# EAGLE design controller (EAGLE 6.4)
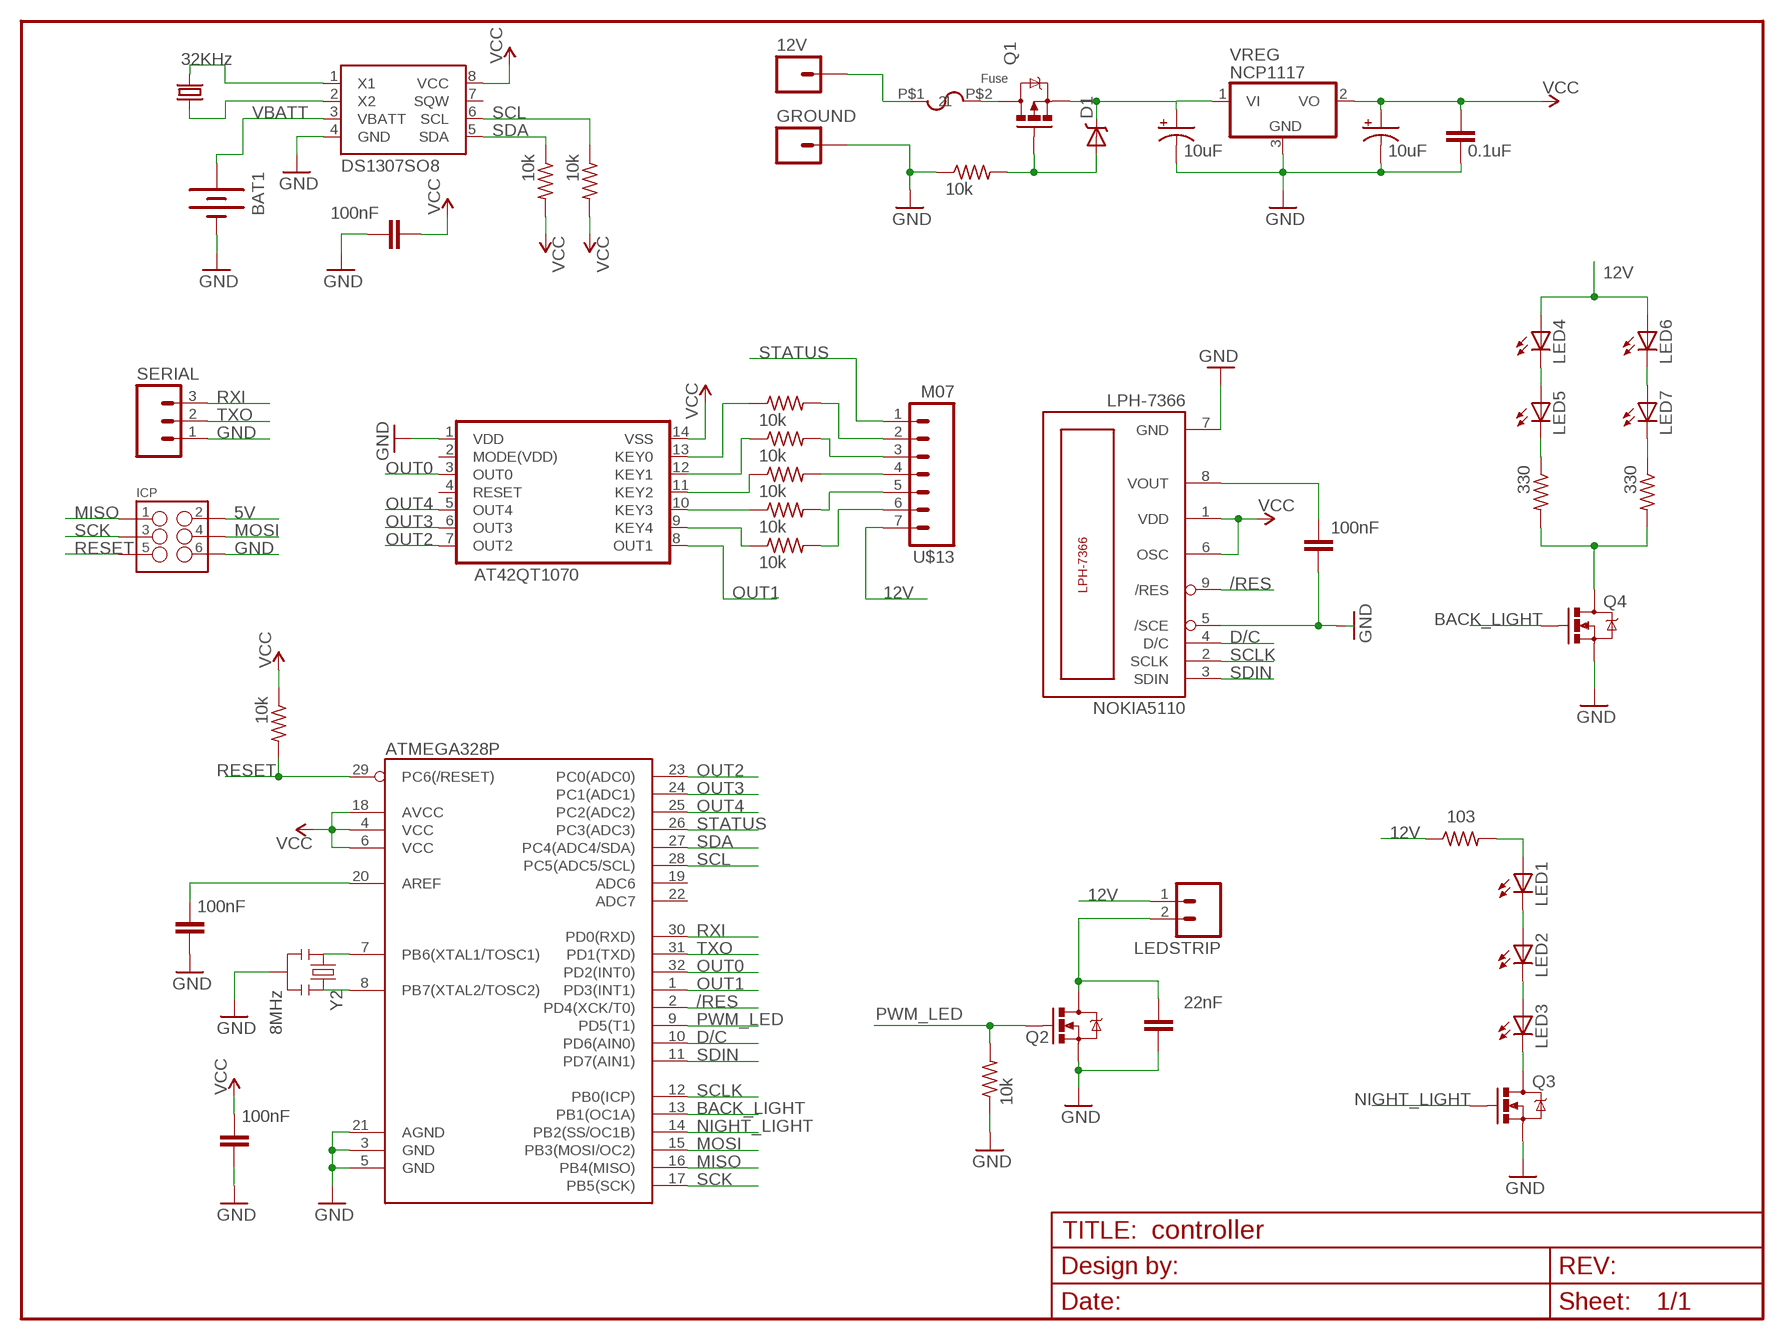
[diagram p0: schematic, sheet 1]

## Parts
12V  M01PTH_LONGPAD  [1X01_LONGPAD]
AT42QT1070  AT42QT1070  [SOIC-14]
BAT1  BATTERY12MM  [BATTCON_12MM]
C1  100nF  CAP0805  [0805]
C2  100nF  CAP0805  [0805]
C3  100nF  CAP0805  [0805]
C4  22nF  CAP0805  [0805]
C5  10uF  CAP_POL1206-KIT  [EIA3216-KIT]
C6  100nF  CAP0805  [0805]
C7  10uF  CAP_POL1206-KIT  [EIA3216-KIT]
C8  0.1uF  CAP0805  [0805]
D1  DIODE-SCHOTTKYDO-214AA  [DO-214AA]
GROUND  M01PTH_LONGPAD  [1X01_LONGPAD]
ICP  M03X2POGO_PINS  [2X3_POGO]
LED1  LED  [SIDEVIEW-LED]
LED2  LED  [SIDEVIEW-LED]
LED3  LED  [SIDEVIEW-LED]
LED4  LED0603  [LED-0603]
LED5  LED0603  [LED-0603]
LED6  LED0603  [LED-0603]
LED7  LED0603  [LED-0603]
LEDSTRIP  M02LOCK_LONGPADS  [1X02_LOCK_LONGPADS]
NOKIA5110  LPH-7366  [NOKIA5110]
Q1  MOSFET_PCHANNEL  [DPAK]
Q2  MOSFET-NCHANNELFDD8780  [DPAK@1]
Q3  MOSFET-NCHANNELBSS123LT1G  [SOT23]
Q4  MOSFET-NCHANNELBSS123LT1G  [SOT23]
SERIAL  M03POGO_PIN_HOLES_ONLY  [1X03_PP_HOLES_ONLY]
U1  ATMEGA328P  ATMEGA328_SMT  [TQFP32-08]
U$1  FRAME_LETTER  [CREATIVE_COMMONS]
U$2  10k  RESISTOR  [RESISTOR-0805]
U$3  DS1307SO8  [SO08]
U$4  10k  RESISTOR  [RESISTOR-0805]
U$5  10k  RESISTOR  [RESISTOR-0805]
U$7  10k  RESISTOR  [RESISTOR-0805]
U$8  10k  RESISTOR  [RESISTOR-0805]
U$9  10k  RESISTOR  [RESISTOR-0805]
U$10  10k  RESISTOR  [RESISTOR-0805]
U$11  10k  RESISTOR  [RESISTOR-0805]
U$12  Fuse  FUSE  [FUSE-LITTLE-251]
U$13  M07  [M07-SMD]
U$14  10k  RESISTOR  [RESISTOR-0805]
U$15  10k  RESISTOR  [RESISTOR-0805]
U$16  103  RESISTOR  [RESISTOR-0805]
U$17  330  RESISTOR  [RESISTOR-0805]
U$18  330  RESISTOR  [RESISTOR-0805]
VREG  NCP1117  7805DT  [TO252]
Y1  32KHz  CRYSTAL32-SMD  [CRYSTAL-32KHZ-SMD]
Y2  8MHz  RESONATOR16MHZ  [RESONATOR-SMD]

## Nets
5V [5V]: AT42QT1070.14(VSS) C2.1 C3.1 C7.A(+) C8.1 ICP.P$2 NOKIA5110.1(VDD) NOKIA5110.6(OSC) U1.4(VCC) U1.6(VCC) U1.18(AVCC) U$2.1 U$3.8(VCC) U$4.2 U$5.2 VREG.2(VO) ; supply symbol labelled VCC
12V: C5.A(+) D1.C LED4.A LED6.A LEDSTRIP.1 Q1.3(S) U$13.7 U$16.1 VREG.1(VI)
/RES: NOKIA5110.9(/RES) U1.2(PD4(XCK/T0))
BACK_LIGHT: Q4.1(G) U1.13(PB1(OC1A))
D/C: NOKIA5110.4(D/C) U1.10(PD6(AIN0))
GND: AT42QT1070.1(VDD) BAT1.GND(-) C1.2 C2.2 C3.2 C4.1 C5.C(-) C6.1 C7.C(-) C8.2 GROUND.1 ICP.P$6 NOKIA5110.5(/SCE) NOKIA5110.7(GND) Q2.3(S) Q3.2(S) Q4.2(S) SERIAL.1 U1.3(GND) U1.5(GND) U1.21(AGND) U$3.4(GND) U$14.1 U$15.1 VREG.3(GND) Y2.2
KEY0: AT42QT1070.13(KEY0) U$7.1
KEY1: AT42QT1070.12(KEY1) U$8.1
KEY2: AT42QT1070.11(KEY2) U$9.1
KEY3: AT42QT1070.10(KEY3) U$10.1
KEY4: AT42QT1070.9(KEY4) U$11.1
MISO: ICP.P$1 U1.16(PB4(MISO))
MOSI: ICP.P$4 U1.15(PB3(MOSI/OC2))
N$1: U1.7(PB6(XTAL1/TOSC1)) Y2.1
N$2: LED7.C U$18.1
N$4: U1.8(PB7(XTAL2/TOSC2)) Y2.3
N$5: LED4.C LED5.A
N$6: U$3.1(X1) Y1.X2
N$7: U$3.2(X2) Y1.X1
N$8: 12V.1 U$12.P$1
N$9: LED5.C U$17.1
N$10: Q4.3(D) U$17.2 U$18.2
N$11: C1.1 U1.20(AREF)
N$12: LED1.P$1(A) U$16.2
N$13: Q1.4(D) U$12.P$2
N$14 [12V]: C4.2 LEDSTRIP.2 Q2.4(D)
N$15: LED1.P$2(C) LED2.P$1(A)
N$16: D1.A Q1.1(G) U$14.2
N$17: LED6.C LED7.A
N$19: U$9.2 U$13.4
N$20: C6.2 NOKIA5110.8(VOUT)
N$21: U$11.2 U$13.6
N$22: LED2.P$2(C) LED3.P$1(A)
N$28: U$10.2 U$13.5
N$30: U$8.2 U$13.3
N$31: U$7.2 U$13.2
N$33: LED3.P$2(C) Q3.3(D)
NIGHT_LIGHT: Q3.1(G) U1.14(PB2(SS/OC1B))
OUT0: AT42QT1070.3(OUT0) U1.32(PD2(INT0))
OUT1: AT42QT1070.8(OUT1) U1.1(PD3(INT1))
OUT2: AT42QT1070.7(OUT2) U1.23(PC0(ADC0))
OUT3: AT42QT1070.6(OUT3) U1.24(PC1(ADC1))
OUT4: AT42QT1070.5(OUT4) U1.25(PC2(ADC2))
PWM_LED: Q2.1(G) U1.9(PD5(T1)) U$15.2
RESET: ICP.P$5 U1.29(PC6(/RESET)) U$2.2
RXI: SERIAL.3 U1.30(PD0(RXD))
SCK: ICP.P$3 U1.17(PB5(SCK))
SCL: U1.28(PC5(ADC5/SCL)) U$3.6(SCL) U$5.1
SCLK: NOKIA5110.2(SCLK) U1.12(PB0(ICP))
SDA: U1.27(PC4(ADC4/SDA)) U$3.5(SDA) U$4.1
SDIN: NOKIA5110.3(SDIN) U1.11(PD7(AIN1))
STATUS: U1.26(PC3(ADC3)) U$13.1
TXO: SERIAL.2 U1.31(PD1(TXD))
VBATT: BAT1.PWR@1(+) U$3.3(VBATT)
Unconnected: AT42QT1070.2(MODE(VDD)) AT42QT1070.4(RESET) U1.19(ADC6) U1.22(ADC7) U$3.7(SQW)

## Library data of the parts
12V GROUND = SparkFun-Connectors:M01: Header 1 Standard 1-pin 0.1" header. Use with straight break away headers (SKU : PRT-00116), right angle break away headers (PRT-00553), swiss pins (PRT-00743), machine pins (PRT-00117), and female headers (PRT-00115).
AT42QT1070 = jt_parts:AT42QT1070: Modified from the Sparkfun footprint
BAT1 = SparkFun-Electromechanical:BATTERY: Battery Holders Various common sizes : AA, AAA, 20mm coin cell and 12mm coin cell. 20MM_4LEGS, BATT-10373
C1-C4 C6 C8 = SparkFun-Capacitors:CAP: Capacitor Standard 0603 ceramic capacitor, and 0.1" leaded capacitor.
C5 C7 = SparkFun-Capacitors:CAP_POL: Capacitor Polarized These are standard SMD and PTH capacitors. Normally 10uF, 47uF, and 100uF in electrolytic and tantalum varieties. Always verify the external diameter of the through hole cap, it varies with capacity, voltage, and manufacturer. The EIA devices should be standard.
D1 = jt_parts:DIODE-SCHOTTKY
ICP = SparkFun-Connectors:M03X2: 2x3 .1" header. Shrouded, with keying- CONN-10681 SMT- CONN-11415 Pogo pins- HW-11044; PROD_ID: HW-11044
LED1-LED3 = jt_parts:LED
LED4-LED7 = SparkFun-LED:LED: LEDs Standard schematic elements and footprints for 5mm, 3mm, 1206, and 0603 sized LEDs. 5mm - Spark Fun Electronics SKU : COM-00529 (and others)
LEDSTRIP = SparkFun-Connectors:M02: Standard 2-pin 0.1" header. Use with - straight break away headers ( PRT-00116) - right angle break away headers (PRT-00553) - swiss pins (PRT-00743) - machine pins (PRT-00117) - female headers (PRT-00115) Molex polarized connector foot print use with: PRT-08233 with associated crimp pins and housings. 2.54_SCREWTERM for use with PRT-10571. 3.5mm Screw Terminal footprints for PRT-08084 5mm Screw Terminal footprints for use with PRT-08433
NOKIA5110 = jt_parts:LPH-7366
Q1 = jt_parts:MOSFET_PCHANNEL
Q2 = SparkFun-DiscreteSemi:MOSFET-NCHANNEL: Common NMOSFET Parts MFG P/N Store ID Prod ID FDD8780 TRANS-09984 SI7820DN TRANS-11055 FDS6630A IC-08089 2N7002PW TRANS-11151 FQP30N06L COM-10213 TRANS-10060 BSS123LT1G TRANS-08345 BSS138 TRANS-00830 BS170 2N7000; PROD_ID: TRANS-09984
Q3 Q4 = SparkFun-DiscreteSemi:MOSFET-NCHANNEL: Common NMOSFET Parts MFG P/N Store ID Prod ID FDD8780 TRANS-09984 SI7820DN TRANS-11055 FDS6630A IC-08089 2N7002PW TRANS-11151 FQP30N06L COM-10213 TRANS-10060 BSS123LT1G TRANS-08345 BSS138 TRANS-00830 BS170 2N7000; PROD_ID: TRANS-08345
SERIAL = SparkFun-Connectors:M03: Header 3 Standard 3-pin 0.1" header. Use with straight break away headers (SKU : PRT-00116), right angle break away headers (PRT-00553), swiss pins (PRT-00743), machine pins (PRT-00117), and female headers (PRT-00115). Molex polarized connector foot print use with SKU : PRT-08232 with associated crimp pins and housings.
U1 = SparkFun-DigitalIC:ATMEGA328_SMT: 32-Pin Atmega328 part Commonly used on Arduino compatible boards Available in QFP and QFN packages TQFP is IC-09069 QFN is non-stock; PROD_ID: IC-09069
U$1 = jt_parts:FRAME_LETTER: 8.5" x 11" document frame modified from the Sparkfun Aesthetics Library
U$2 U$4 U$5 U$7-U$11 U$14-U$18 = jt_parts:RESISTOR: Resistor footprints. 0805 modified from Adafruit library.
U$3 = SparkFun-FreqCtrl:DS1307: I2C real-time clock with battery backup.
U$12 = jt_parts:FUSE
U$13 = jt_parts:M07
VREG = adafruit:78*: Positive VOLTAGE REGULATOR Added bigger pads to the TO-92 package
Y1 = SparkFun-FreqCtrl:CRYSTAL: Various standard crystals. Proven footprints. Spark Fun Electronics SKU : COM-00534
Y2 = SparkFun-FreqCtrl:RESONATOR: Resonator Small SMD resonator. Used, eg, on the Arduino Pro/ Pro Mini boards. 8MHz- XTAL-08895 16MHz- XTAL-08900; PROD_ID: XTAL-08900; VALUE: 16MHz

## Net classes
0 default: width 0.254 mm, clearance 0.203 mm
1 12V: width 2.032 mm, clearance 0.508 mm
2 5V: width 0.305 mm, clearance 0.203 mm

## Board
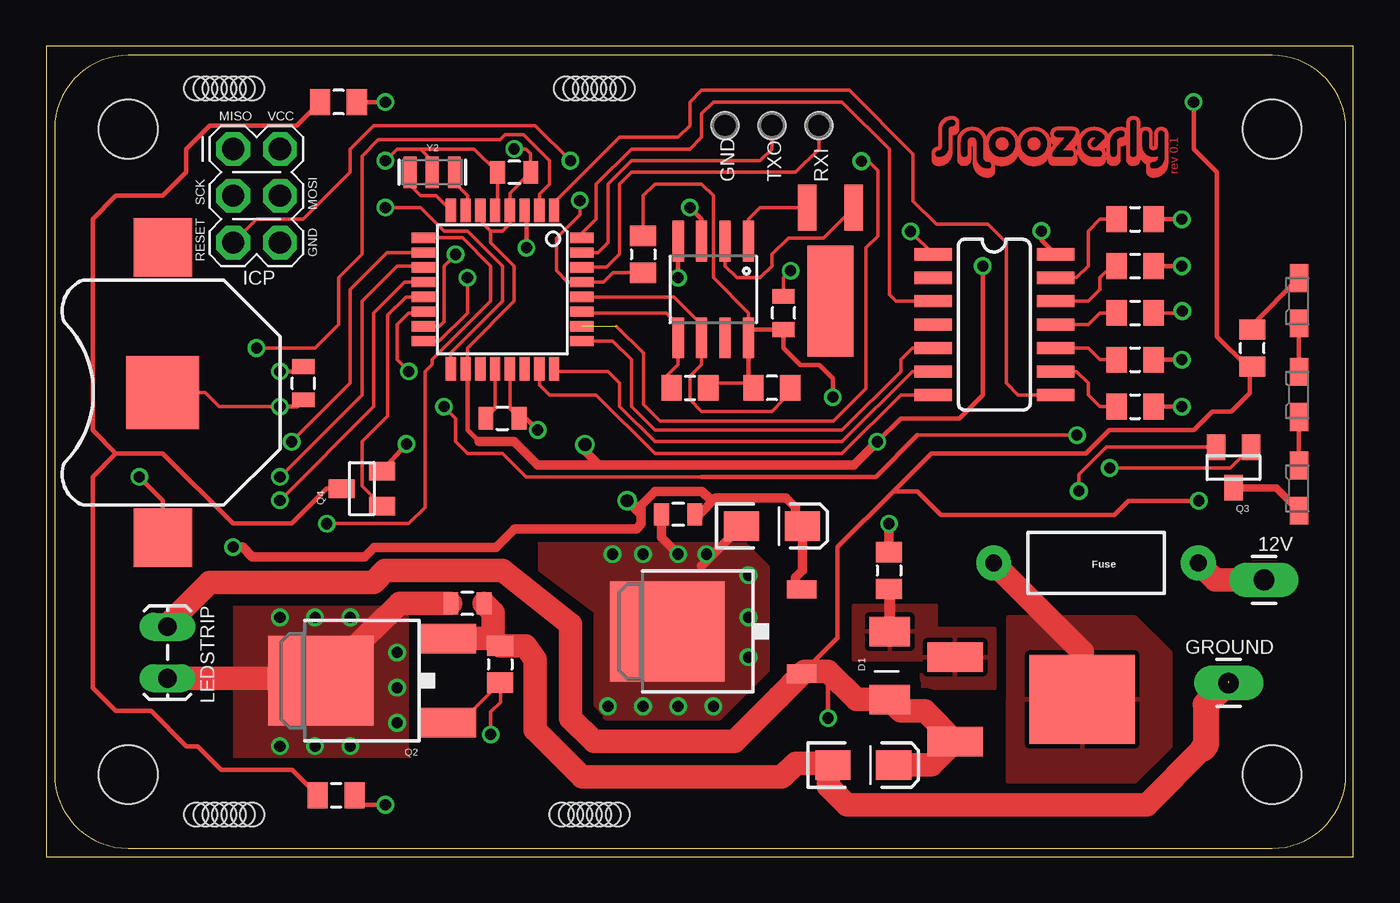
[diagram p1: board, top side]
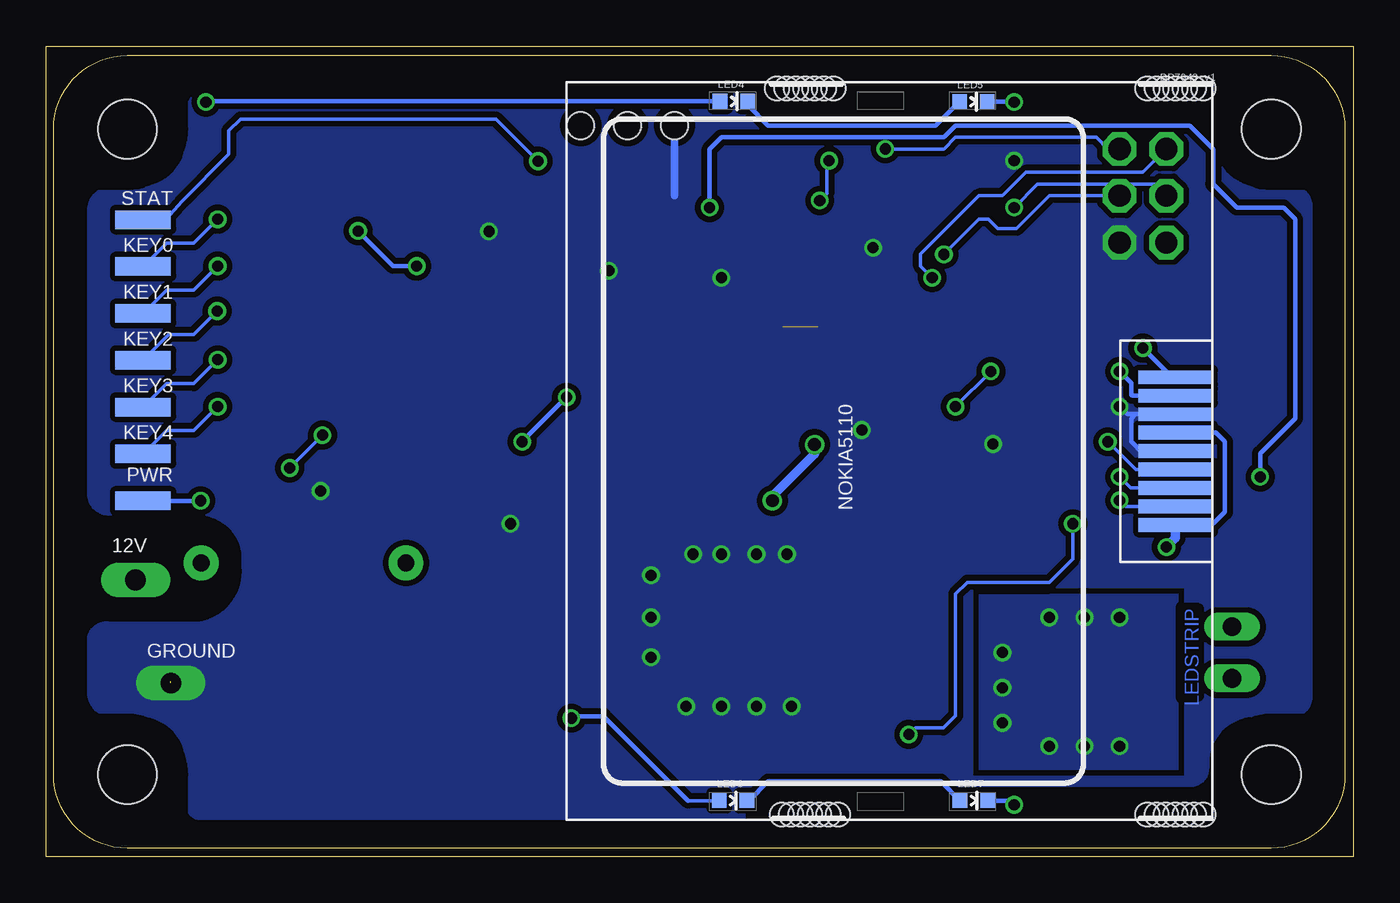
[diagram p2: board, bottom side, seen from below]

Size 70.87 x 43.95 mm. Coordinates in mm from the lower left corner, seen from the top.
Outline: 0,0 70.87,0 70.87,43.95 0,43.95 0,0
Copper layers (1*16): Top 0.0356mm / dielectric 1.5011mm / Bottom 0.0356mm
Design rules "LaenPCBOrder": minimum track width 6mil, minimum drill 13mil, track to track 6mil, track to pad 6mil, pad to pad 6mil, via to via 6mil, smd to smd 6mil, copper to edge 15mil, drill to drill 6mil, minimum pad ring 7mil, minimum via ring 7mil, stop-mask expansion 3mil, vias tented up to drill 0mil, thermal gap 10mil
Holes 1.3 mm at 8.13,2.29 8.64,2.29 9.14,2.29 9.65,2.29 10.16,2.29 10.67,2.29 11.18,2.29 27.94,2.29 28.45,2.29 28.96,2.29 29.46,2.29 29.97,2.29 30.48,2.29 30.99,2.29 8.13,41.66 8.64,41.66 9.14,41.66 9.65,41.66 10.16,41.66 10.67,41.66 11.18,41.66 28.19,41.66 28.7,41.66 29.21,41.66 29.72,41.66 30.23,41.66 30.73,41.66 31.24,41.66

### Footprints (pad centres in the part's own frame; a part is rotated, then mirrored left to right if it is on the bottom)
1X01_LONGPAD = drill 1.118 pad 1.88 long: 1 0,0
SOIC-14 = smd 0.66 x 2.032: 1 -3.175,-3.315; 2 -1.905,-3.315; 3 -0.635,-3.315; 4 0.635,-3.315; 5 1.905,-3.315; 6 3.175,-3.315; 7 4.445,-3.315; 8 4.445,3.315; 9 3.175,3.315; 10 1.905,3.315; 11 0.635,3.315; 12 -0.635,3.315; 13 -1.905,3.315; 14 -3.175,3.315
BATTCON_12MM = smd 3.962 x 3.962: GND 0,0 | smd 3.175 x 3.175: PWR@1 -7.874,0; PWR@2 7.874,0
0805 = smd 0.8 x 1.2: 1 -0.9,0; 2 0.9,0
EIA3216-KIT = smd 1.9 x 1.6: A 1.65,0; C -1.65,0
DO-214AA = smd 1.6 x 2.2: A 2.16,-0.17; C -1.53,-0.17
2X3_POGO = drill 1.2 pad 1.829 octagon: P$1 0,0; P$2 0,2.54; P$3 2.54,0; P$4 2.54,2.54; P$5 5.08,0; P$6 5.08,2.54
SIDEVIEW-LED = smd 1 x 1.5: P$1 0,-1.25; P$2 0,1.2
LED-0603 = smd 0.8 x 0.8: A 0,-0.75; C 0,0.75
1X02_LOCK_LONGPADS = drill 1.016 long: 1 -0.127,0; 2 2.667,0
NOKIA5110 = smd 0.75 x 4: 1 4,17; 2 3,17; 3 2,17; 4 1,17; 5 0,17; 6 -1,17; 7 -2,17; 8 -3,17; 9 -4,17
DPAK = smd 1.6 x 3: 1 -2.28,-2.77; 3 2.28,-2.77 | smd 4.826 x 5.715: 4 0,4.128
DPAK' = smd 1.6 x 3: 1 -2.28,-5.31; 3 2.28,-5.31 | smd 4.826 x 5.715: 4 0,1.588
SOT23 = smd 1 x 1.4: 1 -0.95,-1.1; 2 0.95,-1.1; 3 0,1.1
1X03_PP_HOLES_ONLY = drill 0.9 pad 0.813: 1 0,0; 2 2.54,0; 3 5.08,0 | hole 1.473: 0,0; 2.54,0; 5.08,0
TQFP32-08 = smd 1.27 x 0.559: 1 -4.293,2.8; 2 -4.293,2; 3 -4.293,1.2; 4 -4.293,0.4; 5 -4.293,-0.4; 6 -4.293,-1.2; 7 -4.293,-2; 8 -4.293,-2.8; 17 4.293,-2.8; 18 4.293,-2; 19 4.293,-1.2; 20 4.293,-0.4; 21 4.293,0.4; 22 4.293,1.2; 23 4.293,2; 24 4.293,2.8 | smd 0.559 x 1.27: 9 -2.8,-4.293; 10 -2,-4.293; 11 -1.2,-4.293; 12 -0.4,-4.293; 13 0.4,-4.293; 14 1.2,-4.293; 15 2,-4.293; 16 2.8,-4.293; 25 2.8,4.293; 26 2,4.293; 27 1.2,4.293; 28 0.4,4.293; 29 -0.4,4.293; 30 -1.2,4.293; 31 -2,4.293; 32 -2.8,4.293
RESISTOR-0805 = smd 1.1 x 1.4: 1 -1,0; 2 1,0
SO08 = smd 0.61 x 2.21: 1 -1.905,-2.616; 2 -0.635,-2.616; 3 0.635,-2.616; 4 1.905,-2.616; 5 1.905,2.616; 6 0.635,2.616; 7 -0.635,2.616; 8 -1.905,2.616
FUSE-LITTLE-251 = drill 0.9 pad 1.88: P$1 -6.35,-0.03; P$2 4.75,-0.03
M07-SMD = smd 1 x 3: 1 -7.62,-0.08; 2 -5.08,-0.08; 3 -2.54,-0.08; 4 0,-0.08; 5 2.54,-0.08; 6 5.08,-0.08; 7 7.62,-0.08
DP7043_V1 = hole 3.2: 4,4; 66,4; 66,39; 4,39
TO252 = smd 1 x 1.6: 1 -2.28,-4.8; 2 2.28,-4.8 | smd 5.4 x 6.2: 3 0,2.5
CRYSTAL-32KHZ-SMD = smd 2.5 x 6: SHEILD 0,5.08 | smd 1 x 2.5: X1 -1.27,0; X2 1.27,0
RESONATOR-SMD = smd 0.7 x 1.7: 1 -1.2,0; 2 0,0; 3 1.2,0

### Placement (x,y rotation side)
12V  66.01,15.01 90 top
AT42QT1070  51.41,29.49 270 top
BAT1  6.32,25.17 90 top
C1  24.74,23.77 0 top
C2  25.37,37.11 180 top
C3  39.98,29.49 90 top
C4  22.83,13.74 180 top
C5  44.3,4.98 0 top
C6  13.94,25.68 90 top
C7  39.34,17.93 0 top
C8  34.26,18.57 180 top
D1  45.57,10.06 90 top
GROUND  64.11,9.42 90 top
ICP  10.13,38.38 270 top
LED1  67.92,30.12 180 top
LED2  67.92,25.04 180 top
LED3  67.92,19.96 180 top
LED4  33.58,40.97 270 bottom
LED5  20.6,40.94 270 bottom
LED6  33.63,3.05 270 bottom
LED7  20.57,3.05 270 bottom
LEDSTRIP  6.58,12.34 270 top
NOKIA5110  26.64,22 270 bottom
Q1  52.04,8.53 270 top
Q2  MOSFET-NCHANNELFDD8780  [DPAK']  16.48,9.55 90 top
Q3  64.36,21.11 180 top
Q4  17.12,19.96 90 top
SERIAL  36.8,39.65 0 top
U1  24.74,30.76 270 top
U$1  -15.24,-11.43 0 top  (outside the outline)
U$2  32.36,32.66 270 top
U$3  36.17,30.76 180 top
U$4  34.9,25.43 0 top
U$5  39.34,25.43 180 top
U$6  [SNOOZERLY_TOP]  48.01,36.83 0 top
U$7  59.03,34.57 0 top
U$8  59.03,32.03 0 top
U$9  59.03,29.49 0 top
U$10  59.03,26.95 0 top
U$11  59.03,24.41 0 top
U$12  56.11,15.9 180 top
U$13  65.53,26.92 270 bottom
U$14  45.69,15.52 270 top
U$15  24.61,10.44 270 top
U$16  65.38,27.58 90 top
U$17  15.85,40.92 180 top
U$18  15.72,3.33 180 top
U$20  [DP7043_V1]  70.46,43.46 180 top
VREG  36.17,12.22 90 top
Y1  42.52,35.2 180 top
Y2  20.93,37.11 180 top

### Tracks (layer width: path | path; a pad name or v marks a point on that pad's centre or on a via)
5V  (via drill 0.6, 0.7)
  Top 0.203: U1.6 23.47,34.98 23.47,34.57 24.11,33.93 | U1.18 22.84,26.56 22.84,27.58 25.38,30.12 25.38,32.03 24.11,33.3 24.11,33.93 | 24.11,33.93 24.74,33.93 25.14,34.33 U1.4 25.14,35.97 C2.1 26.27,38.11 26.01,38.38 v25.38,38.38 | 38.08,25.7 36.17,25.7 U$4.2 | 38.08,28.85 38.08,29.49 36.17,31.39 36.17,35.84 35.53,36.47 32.99,36.47 32.36,35.84 U$2.1 | 38.08,28.85 U$3.8 | 38.34,28.59 38.08,28.85
  Top 0.254: U$3.8 38.08,25.7 U$5.2 | 38.34,28.59 C3.1 39.98,27.58 40.89,26.67 41.91,26.67 42.65,25.93 v42.65,24.92 | C8.1 35.41,18.57 | v45.06,22.5 46.33,23.77 49.51,23.77 50.77,25.04 v50.77,32.03 | v53.95,33.93 53.95,33.44 AT42QT1070.14 | 23.47,22.5 22.84,23.14 22.84,26.37 U1.18
  Top 0.508: VREG.2 40.62,14.78 40.62,15.14 40.99,15.52 C7.A 40.62,18.31 40.62,18.95 40.11,19.46 36.3,19.46 36.23,19.39 | 35.41,18.57 36.23,19.39 | 29.97,21.23 43.79,21.23 v45.06,22.5 | 29.97,21.23 26.64,21.23 25.38,22.5 23.47,22.5 | v10.13,16.79 10.64,16.79 11.18,16.26 17.27,16.26 17.78,16.76 24.38,16.76 25.4,17.78 32,17.78 32.26,18.03 32.26,18.54 | 36.23,19.39 35.98,19.39 35.56,19.81 33.02,19.81 32.26,19.05 32.26,18.54 | 32.26,18.54 v31.5,19.3 | v29.21,22.35 29.21,22 29.97,21.23
  Bottom 0.203: ICP.P$2 13.31,38.38 13.95,39.01 21.57,39.01 22.2,38.38 v25.38,38.38
  Bottom 0.254: v42.65,24.92 v45.06,22.5 | v50.77,32.03 52.05,32.03 v53.95,33.93 | NOKIA5110.6 7.45,23 6.96,22.5 6.96,18.69 7.59,18.06 9.58,18.06 NOKIA5110.1
  Bottom 0.508: NOKIA5110.1 9.64,17.28 v10.13,16.79 | v31.5,19.3 31.5,19.56 29.21,21.84 v29.21,22.35
12V  (via drill 0.6)
  Top 0.254: v42.39,7.52 42.39,10.05 | v62.2,40.92 62.2,38.38 63.48,37.11 63.48,28.22 65.11,26.58 U$16.1 65.25,26.46 65.25,25.16 64.25,24.16 63.22,24.16 62.2,23.14 57.63,23.14 56.36,21.87 47.98,21.87 45.95,19.84 | VREG.1 42.9,11.87 42.9,16.79 45.95,19.84 | v62.48,19.3 58.67,19.3 57.91,18.54 48.51,18.54 47.24,19.81 45.97,19.81 45.95,19.84
  Top 1.27: 45.62,8.41 D1.C | C5.A 48,4.98 Q1.3 47.63,7.9 46.33,7.9 45.74,8.49 D1.C | LEDSTRIP.1 6.58,12.6 8.87,14.88 17.75,14.88 18.39,15.52 24.74,15.52 28.42,12.6 28.42,7.52 29.69,6.25 37.31,6.25 39.7,8.63 VREG.1 39.73,8.67 41.12,10.06 41.13,10.05 42.39,10.05 43.92,8.53 D1.C
  Bottom 0.203: LED6.A 36.07,3.05
  Bottom 0.254: LED4.A 62.15,40.97 v62.2,40.92 | 36.07,3.05 40.64,7.62 42.29,7.62 v42.39,7.52 | U$13.7 v62.48,19.3
/RES  (via drill 0.6)
  Top 0.203: v11.4,27.58 14.58,27.58 15.85,28.85 15.85,31.39 17.12,32.66 17.12,38 18.01,38.89 24.61,38.89 24.87,39.14 25.88,39.14 27.28,37.74 27.28,36.47 26.74,35.93 U1.2
  Bottom 0.254: NOKIA5110.9 9.82,26 v11.4,27.58
BACK_LIGHT
  Top 0.203: U1.13 19.51,30.36 18.52,29.36 18.52,23.9 17.12,22.5 17.12,20.09 17.14,20.09 Q4.1
D/C  (via drill 0.6)
  Top 0.203: U1.10 18.48,32.76 16.48,30.76 16.48,25.68 v13.31,22.5
  Bottom 0.203: NOKIA5110.4 11.8,21 v13.31,22.5
GND  (via drill 0.6)  (1 unrouted)
  Top 0.203: U1.21 25.14,24.27 C1.2 | U1.5 24.48,35.19 C2.2 23.2,38.38 20.3,38.38 | v18.39,37.74 19.02,38.38 20.3,38.38 | Y2.2 20.93,37.74 20.3,38.38 | 39.98,30.76 39.98,31.39 v40.36,31.77 | v12.68,24.41 9.37,24.41 8.61,25.17 BAT1.GND | 19.49,22.33 v19.53,22.38 | Q3.2 57.46,22.21 55.98,20.73 v55.98,19.84 | AT42QT1070.1 48.09,32.68 v46.86,33.91
  Top 0.254: C1.2 26.01,23.77 v26.64,23.14 | U$3.4 v34.27,31.39 | C3.2 39.98,30.76 | v12.68,24.41 13.57,24.41 C6.1 | Q4.2 19.49,22.33 | v26.04,33.02 26.04,34.96 U1.3
  Top 0.508: C7.C 35.54,15.77 | v34.27,16.41 33.37,17.31 C8.2 | U$14.1 v45.7,18.06
  Top 1.27: 62.71,5.87 59.66,2.82 43.41,2.82 42.42,3.81 42.42,4.75 C5.C 42.55,5.08 40.64,5.08 39.9,4.34 29.06,4.34 26.52,6.88 26.52,10.69 25.99,11.44 U$15.1 24.22,11.83 | Q2.3 24.22,11.83 | 24.22,11.83 24.22,13.25 C4.1
  Top 1.422: 62.71,5.87 62.87,6.02 62.87,8.26 64.11,9.5
  Bottom 0.254: NOKIA5110.7 11.82,24 | 11.82,24 12.04,23.77 12.04,22.5 11.4,21.87 9.77,21.87 NOKIA5110.5 | 11.82,24 12.26,24 v12.68,24.41
  Bottom 0.406: SERIAL.1 36.8,35.84
  other vias: 30.71,16.41 30.45,8.15 32.36,16.41 32.36,8.15 34.26,8.15 36.17,8.15 38.07,15.27 38.07,12.98 38.07,10.82 35.79,16.41
  pour Top (no thermals): 29.69,8.15 29.69,13.23 26.67,15.49 26.67,17.04 37.95,17.04 39.22,15.77 39.22,10.06 36.55,7.39 30.33,7.39 30.2,7.52 30.2,7.65
  pour Bottom (isolate 0.305, rank 2, no thermals): 2.29,35.32 2.29,8.62 arc90 3.29,7.62 5.33,7.62 arc-90 7.87,5.08 7.87,4.81 arc90 8.87,3.81 32.02,3.81 arc-90 33.02,2.81 33.02,2.03 62.48,2.03 arc90 63.25,2.79 63.25,5.08 arc-90 65.79,7.62 67.31,7.62 arc90 68.58,8.89 68.58,11.94 arc90 67.31,12.7 62.74,12.7 arc-90 60.2,15.75 60.2,16.26 arc-90 62.74,18.54 67.31,18.54 arc90 68.58,19.56 68.58,35.05 arc90 67.31,36.32 65.79,36.32 arc-90 63.25,38.86 63.25,40.39 arc90 61.98,41.66 34.29,41.66 arc90 33.02,40.39 33.02,39.88 8.62,39.88 arc90 7.62,38.88 7.62,38.86 arc-90 5.08,36.32 3.29,36.32 arc90
KEY0
  Top 0.203: AT42QT1070.13 55.85,31.39 56.49,32.03 56.49,33.93 57.12,34.57 U$7.1 57.76,34.57
KEY1
  Top 0.203: AT42QT1070.12 56.49,30.12 57.12,30.76 57.12,31.39 57.76,32.03 U$8.1
KEY2
  Top 0.203: AT42QT1070.11 56.49,28.85 57.12,29.49 U$9.1 58.4,29.49
KEY3
  Top 0.203: AT42QT1070.10 56.49,27.58 57.12,26.95 U$10.1
KEY4
  Top 0.203: AT42QT1070.9 55.85,26.31 56.49,25.68 56.49,25.04 57.12,24.41 U$11.1 57.76,24.41
MISO  (via drill 0.6)
  Top 0.203: v22.84,31.39 22.84,29.49 21.3,27.96 U1.16
  Bottom 0.203: ICP.P$1 11.4,37.11 17.75,37.11 19.02,35.84 20.3,35.84 23.47,32.66 23.47,32.03 v22.84,31.39
MOSI  (via drill 0.6)
  Top 0.203: U1.15 21.31,28.76 21.57,29.01 21.57,32.03 v22.2,32.66
  Bottom 0.203: ICP.P$4 16.48,35.84 18.26,34.06 19.28,34.06 19.79,34.57 20.3,34.57 v22.2,32.66
N$1
  Top 0.203: Y2.1 22.13,36.54 22.84,35.84 22.84,35.15 U1.7
N$2  (via drill 0.6)
  Top 0.254: v18.39,2.82 17.23,2.82 U$18.1
  Bottom 0.254: LED7.C 18.62,3.05 v18.39,2.82
N$4
  Top 0.203: Y2.3 19.73,36.4 20.3,35.84 21.15,35.84 U1.8
N$5
  Bottom 0.254: LED4.C 32.83,40.75 31.73,39.65 22.64,39.65 LED5.A
N$6
  Top 0.203: 38.15,33.3 U$3.1 38.08,34.57 38.71,35.2 Y1.X2
N$7
  Top 0.203: Y1.X1 42.14,33.55 40.23,33.55 39.34,32.66 39.34,32.03 38.71,31.39 37.44,31.39 36.8,32.03 U$3.2
N$8
  Top 1.27: 12V.1 63.38,15.01 U$12.P$1
N$9  (via drill 0.6)
  Top 0.254: v18.39,40.92 U$17.1
  Bottom 0.254: LED5.C 18.41,40.95 v18.39,40.92
N$10
  Top 0.254: 3.79,21.87 2.52,20.6 2.52,9.17 3.79,7.9 5.69,7.9 7.59,5.99 8.23,5.99 9.5,4.72 13.33,4.72 U$18.2 | 3.79,21.87 2.52,23.14 2.52,34.57 3.79,35.84 6.33,35.84 7.59,37.11 7.59,38.38 8.87,39.65 13.58,39.65 U$17.2 | Q4.3 15.21,19.96 13.31,18.06 10.13,18.06 6.33,21.87 3.79,21.87
N$11
  Top 0.203: U1.20 24.34,24.27 C1.1
N$12
  Top 0.203: U$16.2 65.38,28.83
  Top 0.254: 65.38,28.83 LED1.P$1
N$13
  Top 1.27: Q1.4 56.17,11.12 U$12.P$2
  pour Top: 60.93,5.99 59.03,4.09 52.15,4.09 52.17,12.98 59.03,12.98 60.93,11.07
N$14  (via drill 0.6)
  Top 1.27: C4.2 19.15,13.74 17.75,12.34 17.71,12.34 15.21,9.84 15.21,9.8 15.15,9.8 Q2.4 | LEDSTRIP.2 15.72,9.68 16.51,8.89
  other vias: 16.48,5.99 14.58,5.99 12.67,5.99 16.48,12.98 14.58,12.98 12.67,12.98 19.02,7.26 19.02,11.07 19.02,9.17
  pour Top (isolate 0.254, no thermals): 19.66,13.61 10.13,13.61 10.13,5.36 19.66,5.36
  pour Bottom (no thermals): 20.29,4.72 20.29,14.25 9.5,14.25 9.5,4.72
N$15
  Top 0.254: LED1.P$2 LED2.P$1
N$16
  Top 0.61: D1.A 45.74,14.48 U$14.2
  pour Top (isolate 0.61): 51.41,9.17 51.41,12.34 48.23,12.34 48.23,13.61 43.79,13.61 43.79,10.69 47.47,10.69 47.47,9.17
N$17
  Bottom 0.254: LED6.C 32.77,3.05 31.73,4.09 22.36,4.09 LED7.A
N$19  (via drill 0.6)
  Top 0.203: U$9.2 61.49,29.49 v61.59,29.59
  Bottom 0.203: v61.59,29.59 62.87,28.32 64.22,28.32 U$13.4
N$20  (via drill 0.6)
  Top 0.254: v12.68,26.31 13.68,26.31 C6.2
  Bottom 0.254: NOKIA5110.8 11.99,25 12.04,25.04 12.04,25.68 v12.68,26.31
N$21  (via drill 0.6)
  Top 0.254: v61.57,24.41 U$11.2
  Bottom 0.203: v61.57,24.41 62.87,23.11 64.34,23.11 U$13.6
N$22
  Top 0.254: LED2.P$2 LED3.P$1
N$28  (via drill 0.6)
  Top 0.254: v61.57,26.95 U$10.2
  Bottom 0.203: v61.57,26.95 62.87,25.65 64.34,25.65 U$13.5
N$30  (via drill 0.6)
  Top 0.254: v61.57,32.03 U$8.2
  Bottom 0.203: v61.57,32.03 62.87,30.73 64.34,30.73 U$13.3
N$31  (via drill 0.6)
  Top 0.254: v61.57,34.57 U$7.2
  Bottom 0.203: v61.57,34.57 62.87,33.27 64.34,33.27 U$13.2
N$33
  Top 0.254: 67.69,18.99 LED3.P$2
  Top 0.406: Q3.3 66.68,20.01 LED3.P$2
NIGHT_LIGHT  (via drill 0.6)
  Top 0.203: 35.53,20.6 26.01,20.6 24.74,21.87 22.84,21.87 22.2,22.5 22.2,23.77 v21.57,24.41 | v19.66,26.31 19.02,26.95 19.02,28.85 19.66,29.49 20.38,29.49 U1.14 | 47.24,22.86 v55.88,22.86 | v57.66,21.08 64.19,21.08 Q3.1
  Top 0.254: 35.53,20.6 44.98,20.6 47.24,22.86
  Bottom 0.203: v21.57,24.41 v19.66,26.31 | v57.66,21.08 v55.88,22.86
OUT0
  Top 0.203: U1.32 29.03,33.78 29.82,34.57 29.82,36.47 31.73,38.38 34.9,38.38 35.53,39.01 35.53,40.28 36.17,40.92 43.16,40.92 45.72,38.35 45.72,30.48 46.08,30.12 AT42QT1070.3 46.97,30.12
OUT1
  Top 0.203: AT42QT1070.8 52.68,25.04 52.05,25.68 52.05,33.3 51.05,34.29 48.26,34.29 46.99,35.56 46.99,38.1 43.54,41.55 35.53,41.55 34.9,40.92 34.9,39.65 34.27,39.01 31.09,39.01 27.54,35.46 U1.1
OUT2
  Top 0.203: U1.23 26.74,25.58 27.28,25.04 29.82,25.04 32.99,21.87 43.16,21.87 46.33,25.04 AT42QT1070.7
OUT3
  Top 0.203: U1.24 27.69,26.31 30.45,26.31 31.09,25.68 31.09,24.41 32.99,22.5 43.16,22.5 46.97,26.31 AT42QT1070.6
OUT4
  Top 0.203: U1.25 30.71,27.96 31.73,26.95 31.73,24.41 32.99,23.14 43.16,23.14 46.33,26.31 46.33,26.95 46.97,27.58 AT42QT1070.5
PWM_LED  (via drill 0.6)
  Top 0.203: U1.9 22.57,33.56 24.11,32.03 24.11,30.12 20.93,26.95 20.93,26.7 20.55,26.31 20.55,18.95 19.66,18.06 v15.21,18.06 | v24.11,6.63 24.11,7.85 24.64,8.38 24.64,9.41 U$15.2 22.44,7.27 Q2.1
  Bottom 0.203: v15.21,18.06 15.21,16.15 16.48,14.88 20.93,14.88 21.57,14.25 21.57,7.64 22.23,6.99 23.75,6.99 v24.11,6.63
RESET  (via drill 0.6)
  Top 0.203: U$2.2 30.73,31.66 30.22,31.16 U1.29 28.28,31.16 27.66,31.77 27.66,33.55 28.93,34.82 v28.93,35.59 | ICP.P$5 11.4,34.57 13.95,34.57 16.48,37.11 16.48,38.38 17.75,39.65 26.52,39.65 v28.42,37.74
  Bottom 0.203: v28.42,37.74 28.55,37.74 28.55,35.97 v28.93,35.59
RXI
  Top 0.203: U1.30 30.39,31.96 31.09,32.66 31.09,36.47 31.73,37.11 40.62,37.11 41.88,38.38 SERIAL.3
SCK  (via drill 0.6)
  Top 0.203: U1.17 21.94,27.32 24.74,30.12 24.74,32.03 22.84,33.93 21.57,33.93 20.3,35.2 v18.39,35.2
  Bottom 0.203: ICP.P$3 10.77,36.47 17.12,36.47 v18.39,35.2
SCL
  Top 0.203: U$5.1 39.98,25.06 39.98,24.79 39.34,24.16 35.53,24.16 34.9,24.79 34.9,26.06 35.53,26.7 U$3.6 35.53,28.85 34.03,30.36 U1.28
SCLK  (via drill 0.6)
  Top 0.203: v12.68,19.33 17.75,24.41 17.75,29.49 19.43,31.16 U1.12
  Bottom 0.203: NOKIA5110.2 12.34,19 v12.68,19.33
SDA
  Top 0.203: U$4.1 33.63,25.7 33.63,26.06 34.27,26.7 U$3.5 34.27,28.85 33.63,29.49 29.1,29.49 U1.27
SDIN  (via drill 0.6)
  Top 0.203: v12.68,20.6 17.12,25.04 17.12,30.12 19.02,32.03 20.38,32.03 U1.11
  Bottom 0.203: NOKIA5110.3 12.07,20 v12.68,20.6
STATUS  (via drill 0.6)  (1 unrouted)
  Top 0.203: 30.93,28.76 32.38,27.3 32.38,24.51 33.27,23.62 42.67,23.62 44.45,25.4 44.45,33.02 45.09,33.66 45.09,37.21 44.58,37.72 v44.2,37.72
  Bottom 0.203: v44.2,37.72 46.48,40.01 60.33,40.01 60.96,39.37 60.96,38.1 63.5,35.56 64.77,34.12 U$13.1
TXO
  Top 0.203: U1.31 29.91,32.76 30.45,33.3 30.45,36.47 31.73,37.74 38.71,37.74 39.34,38.38 SERIAL.2
VBATT  (via drill 0.6)
  Top 0.254: BAT1.PWR@1 6.33,19.33 v5.05,20.6 | v34.9,35.2 35.53,34.57 U$3.3
  Bottom 0.254: v5.05,20.6 5.05,21.87 3.15,23.77 3.15,34.57 3.79,35.2 6.33,35.2 7.59,36.47 7.59,38.38 8.87,39.65 21.57,39.65 22.2,39.01 34.27,39.01 34.9,38.38 v34.9,35.2

### Text on the board
Top: rev 0.1
Bottom: LEDSTRIP
tNames: MISO | VCC | GND | TXO | RXI | SCK | MOSI | GND | RESET
bNames: STAT | KEY0 | KEY1 | KEY2 | KEY3 | KEY4 | PWR | 12V | GROUND